# EAGLE design DUT-28bit-preCounter (EAGLE 5.07)
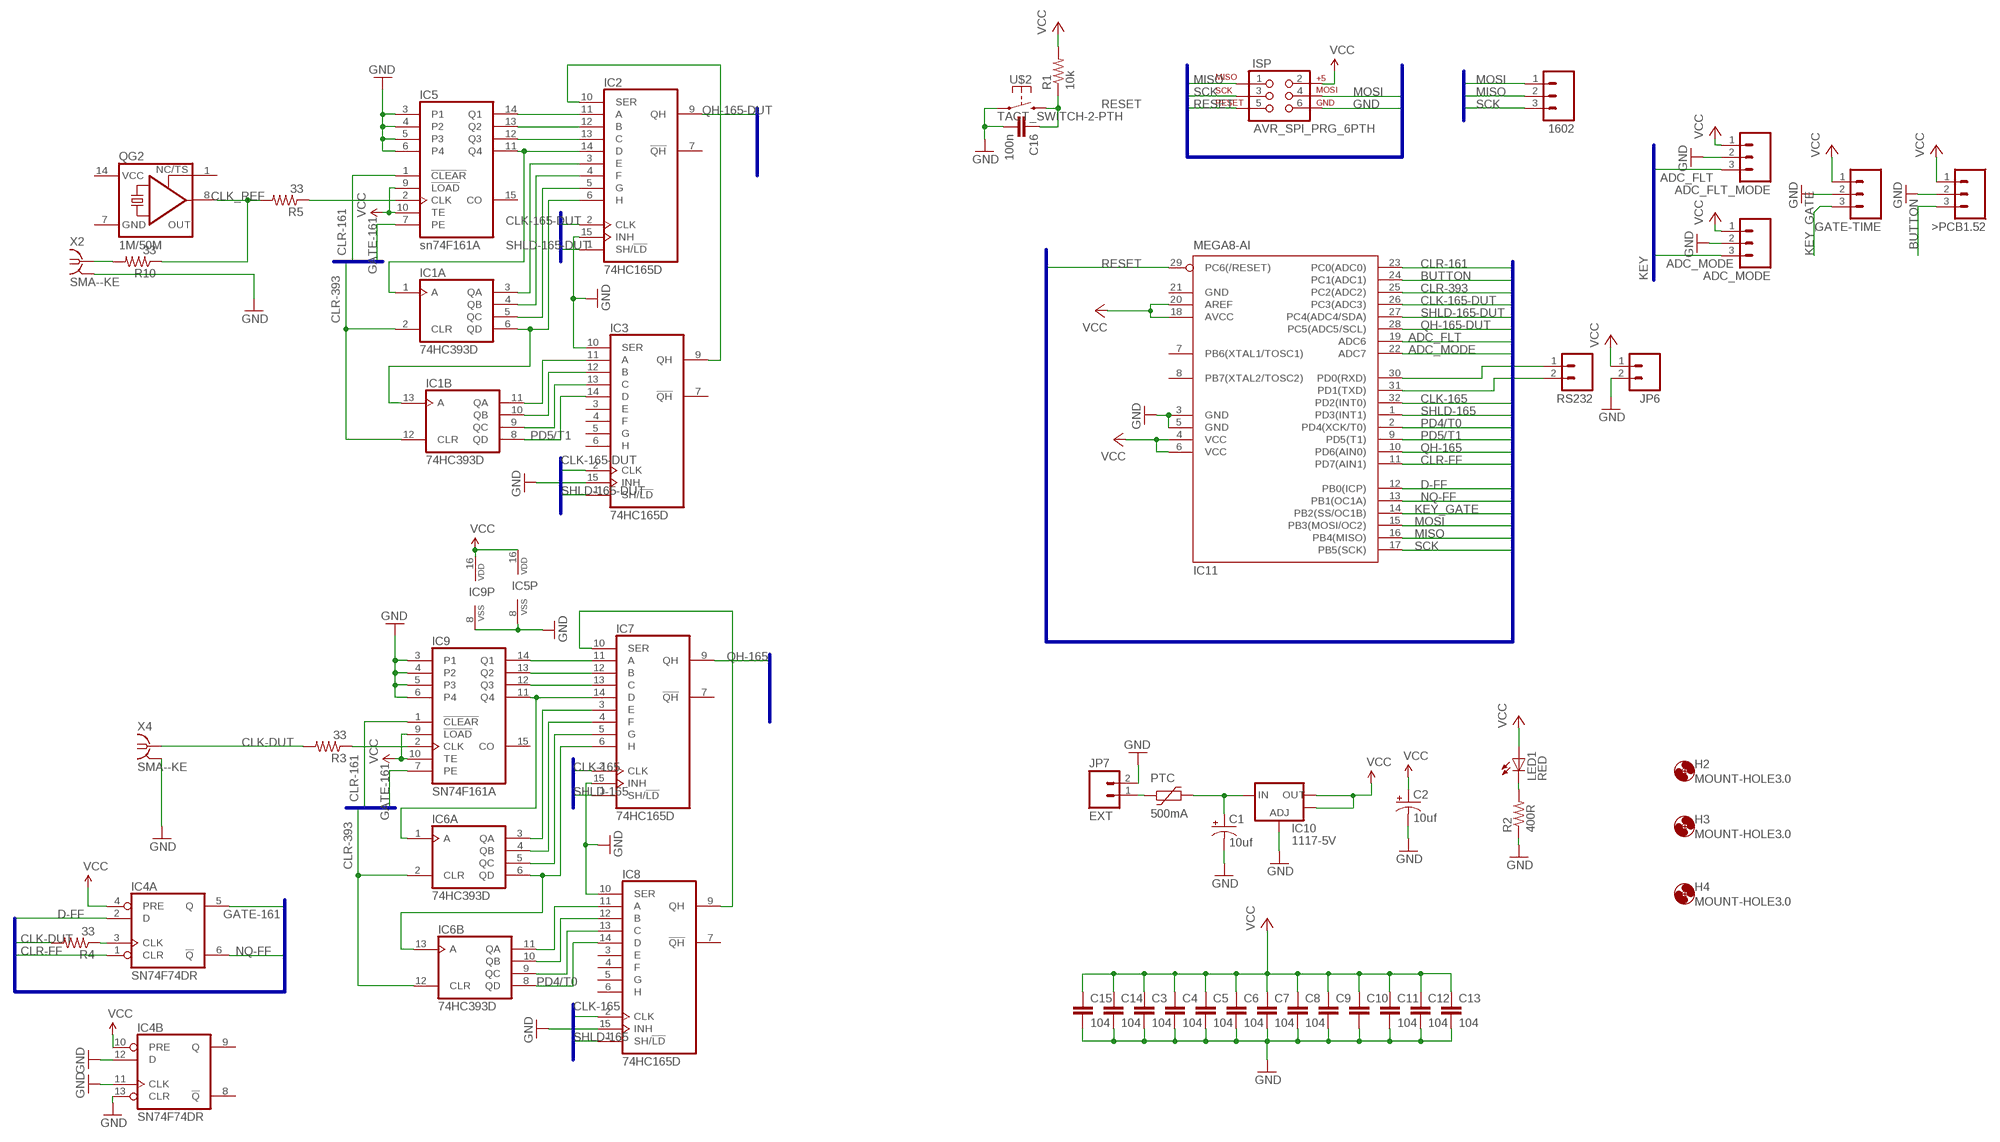
[diagram p0: schematic, sheet 1]

## Parts
1602  M03LOCK_LONGPADS  [1X03_LOCK_LONGPADS]
>PCB1.52  M03PTH  [1X03]
ADC_FLT_MODE  M03PTH  [1X03]
ADC_MODE  M03PTH  [1X03]
C1  10uf  CAP_POL7343  [EIA7343]
C2  10uf  CAP_POL7343  [EIA7343]
C3  104  CAP-C0805K  [C0805K]
C4  104  CAP-C0805K  [C0805K]
C5  104  CAP-C0805K  [C0805K]
C6  104  CAP-C0805K  [C0805K]
C7  104  CAP-C0805K  [C0805K]
C8  104  CAP-C0805K  [C0805K]
C9  CAP-C0805K  [C0805K]
C10  CAP-C0805K  [C0805K]
C11  104  CAP-C0805K  [C0805K]
C12  104  CAP-C0805K  [C0805K]
C13  104  CAP-C0805K  [C0805K]
C14  104  CAP-C0805K  [C0805K]
C15  104  CAP-C0805K  [C0805K]
C16  100n  CAP-C0805K  [C0805K]
GATE-TIME  M03PTH  [1X03]
H2  MOUNT-HOLE3.0  [3,0]
H3  MOUNT-HOLE3.0  [3,0]
H4  MOUNT-HOLE3.0  [3,0]
IC1  74HC393D  [SO14]
IC2  74HC165D  [SO16]
IC3  74HC165D  [SO16]
IC4  SN74F74DR  74HC74D  [SO14]
IC5  sn74F161A  4161D  [SO16]
IC6  74HC393D  [SO14]
IC7  74HC165D  [SO16]
IC8  74HC165D  [SO16]
IC9  SN74F161A  4161D  [SO16]
IC10  1117-5V  V_REG_LM1117SOT223  [SOT223]
IC11  MEGA8-AI  [TQFP32-08]
ISP  AVR_SPI_PRG_6PTH  [2X3]
JP6  CON-02PTH  [1X02]
JP7  EXT  CON-02-XH  [XH-1X2-LONG-LOCK]
LED1  RED  LEDCHIP-LED0805  [CHIP-LED0805]
PTC  500mA  PTC-FUSE1812L  [1812L]
QG2  1M/50M  XO-14  [DIL14S]
R1  10k  RESISTOR0805  [0805]
R2  400R  RESISTOR0805  [0805]
R3  33  RESISTOR0805  [0805]
R4  33  RESISTOR0805  [0805]
R5  33  RESISTOR0805  [0805]
R10  33  RESISTOR0805  [0805]
RS232  CON-02PTH  [1X02]
U$2  TACT_SWITCH-2-PTH  [ALPS-SKHV]
X2  SMA--KE  [SMA-KE]
X4  SMA--KE  [SMA-KE]

## Nets
ADC_FLT: ADC_FLT_MODE.3 IC11.19(ADC6)
ADC_MODE: ADC_MODE.3 IC11.22(ADC7)
BUTTON: >PCB1.52.3 IC11.24(PC1(ADC1))
CLK-165: IC7.2(CLK) IC8.2(CLK) IC11.32(PD2(INT0))
CLK-165-DUT: IC2.2(CLK) IC3.2(CLK) IC11.26(PC3(ADC3))
CLK-DUT: R3.2 R4.2 X4.1
CLK_REF: QG2.8(OUT) R5.2 R10.1
CLR-161: IC5.1(!CLEAR) IC9.1(!CLEAR) IC11.23(PC0(ADC0))
CLR-393: IC1.2(A:CLR) IC1.12(B:CLR) IC6.2(A:CLR) IC6.12(B:CLR) IC11.25(PC2(ADC2))
CLR-FF: IC4.1(A:CLR) IC11.11(PD7(AIN1))
D-FF: IC4.2(A:D) IC11.12(PB0(ICP))
GATE-161: IC4.5(A:Q) IC5.7(PE) IC9.7(PE)
GND: >PCB1.52.2 ADC_FLT_MODE.2 ADC_MODE.2 C1.C(-) C2.C(-) C3.2 C4.2 C5.2 C6.2 C7.2 C8.2 C9.2 C10.2 C11.2 C12.2 C13.2 C14.2 C15.2 C16.2 GATE-TIME.2 IC2.15(INH) IC3.10(SER) IC3.15(INH) IC4.11(B:CLK) IC4.12(B:D) IC4.13(B:CLR) IC5.3(P1) IC5.4(P2) IC5.5(P3) IC5.6(P4) IC5.8(VSS) IC7.15(INH) IC8.10(SER) IC8.15(INH) IC9.3(P1) IC9.4(P2) IC9.5(P3) IC9.6(P4) IC9.8(VSS) IC10.1(ADJ) IC11.3(GND) IC11.5(GND) ISP.6 JP6.2 JP7.2 R2.1 U$2.2 X2.G@1(GND) X4.G@1(GND)
KEY_GATE: GATE-TIME.3 IC11.14(PB2(SS/OC1B))
MISO: 1602.2 IC11.16(PB4(MISO)) ISP.1
MOSI: 1602.1 IC11.15(PB3(MOSI/OC2)) ISP.4
N$1: IC2.11(A) IC5.14(Q1)
N$2: IC2.12(B) IC5.13(Q2)
N$3: IC2.13(C) IC5.12(Q3)
N$4: JP7.1 PTC.P$1
N$5: IC1.3(A:QA) IC2.3(E)
N$6: IC1.4(A:QB) IC2.4(F)
N$7: IC1.5(A:QC) IC2.5(G)
N$8: IC1.6(A:QD) IC1.13(B:A) IC2.6(H)
N$9: IC1.1(A:A) IC2.14(D) IC5.11(Q4)
N$10: IC1.11(B:QA) IC3.11(A)
N$11: IC1.10(B:QB) IC3.12(B)
N$12: IC1.9(B:QC) IC3.13(C)
N$13: IC11.30(PD0(RXD)) RS232.1
N$14: C1.A(+) IC10.3(IN) PTC.P$2
N$15: IC2.10(SER) IC3.9(QH)
N$16: IC7.11(A) IC9.14(Q1)
N$17: IC7.12(B) IC9.13(Q2)
N$18: IC7.13(C) IC9.12(Q3)
N$19: R10.2 X2.1
N$20: IC6.3(A:QA) IC7.3(E)
N$21: IC6.4(A:QB) IC7.4(F)
N$22: IC6.5(A:QC) IC7.5(G)
N$23: IC6.6(A:QD) IC6.13(B:A) IC7.6(H)
N$24: IC6.11(B:QA) IC8.11(A)
N$25: IC6.10(B:QB) IC8.12(B)
N$26: IC6.9(B:QC) IC8.13(C)
N$27: IC11.31(PD1(TXD)) RS232.2
N$28: IC6.1(A:A) IC7.14(D) IC9.11(Q4)
N$29: IC4.3(A:CLK) R4.1
N$30: IC7.10(SER) IC8.9(QH)
N$31: IC9.2(CLK) R3.1
N$32: LED1.C R2.2
N$45: IC5.2(CLK) R5.1
NQ-FF: IC4.6(A:!Q) IC11.13(PB1(OC1A))
PD4/T0: IC6.8(B:QD) IC8.14(D) IC11.2(PD4(XCK/T0))
PD5/T1: IC1.8(B:QD) IC3.14(D) IC11.9(PD5(T1))
QH-165: IC7.9(QH) IC11.10(PD6(AIN0))
QH-165-DUT: IC2.9(QH) IC11.28(PC5(ADC5/SCL))
RESET: C16.1 IC11.29(PC6(/RESET)) ISP.5 R1.1 U$2.3
SCK: 1602.3 IC11.17(PB5(SCK)) ISP.3
SHLD-165: IC7.1(SH/!LD) IC8.1(SH/!LD) IC11.1(PD3(INT1))
SHLD-165-DUT: IC2.1(SH/!LD) IC3.1(SH/!LD) IC11.27(PC4(ADC4/SDA))
VCC: >PCB1.52.1 ADC_FLT_MODE.1 ADC_MODE.1 C2.A(+) C3.1 C4.1 C5.1 C6.1 C7.1 C8.1 C9.1 C10.1 C11.1 C12.1 C13.1 C14.1 C15.1 GATE-TIME.1 IC4.4(A:PRE) IC4.10(B:PRE) IC5.9(!LOAD) IC5.10(TE) IC5.16(VDD) IC9.9(!LOAD) IC9.10(TE) IC9.16(VDD) IC10.2(OUT) IC10.4(OUT) IC11.4(VCC) IC11.6(VCC) IC11.18(AVCC) IC11.20(AREF) ISP.2 JP6.1 LED1.A R1.2
Unconnected: IC2.7(!QH) IC3.3(E) IC3.4(F) IC3.5(G) IC3.6(H) IC3.7(!QH) IC4.8(B:!Q) IC4.9(B:Q) IC5.15(CO) IC7.7(!QH) IC8.3(E) IC8.4(F) IC8.5(G) IC8.6(H) IC8.7(!QH) IC9.15(CO) IC11.7(PB6(XTAL1/TOSC1)) IC11.8(PB7(XTAL2/TOSC2)) QG2.1(TS)

## Buses
MEGA-BUS
KEY

## Power pins joined to a net without a drawn wire
GND: IC1.7(P:GND) IC2.8(GND) IC3.8(GND) IC4.7(P:GND) IC6.7(P:GND) IC7.8(GND) IC8.8(GND) IC11.21(GND) QG2.7(GND) X2.G@2(GND) X2.G@3(GND) X2.G@4(GND) X4.G@2(GND) X4.G@3(GND) X4.G@4(GND)
VCC: IC1.14(P:VCC) IC2.16(VCC) IC3.16(VCC) IC4.14(P:VCC) IC6.14(P:VCC) IC7.16(VCC) IC8.16(VCC) QG2.14(VCC)

## Library data of the parts
1602 >PCB1.52 ADC_FLT_MODE ADC_MODE GATE-TIME = SparkFun:M03: Header 3 Standard 3-pin 0.1" header. Use with straight break away headers (SKU : PRT-00116), right angle break away headers (PRT-00553), swiss pins (PRT-00743), machine pins (PRT-00117), and female headers (PRT-00115). Molex polarized connector foot print use with SKU : PRT-08232 with associated crimp pins and housings.
C1 C2 = digital-toy:CAP_POL: Capacitor Polarized These are standard SMD and PTH capacitors. Normally 10uF, 47uF, and 100uF in electrolytic and tantalum varieties. Always verify the external diameter of the through hole cap, it varies with capacity, voltage, and manufacturer. The EIA devices should be standard. PANASONIC_D size: 6.5mmx6.5mmx5.5mm, 100uf (taobao:6.3mmx5.5mm), same as CVL0605 153cvl0405 size: 4mmx4mmx5.5mm, 10uf (taobao:4mmx5.5mm) ct6032 typical 47uF Tantalum, comment by hyl.
C3-C16 = digital-toy:CAP: Capacitor Standard 0603 ceramic capacitor, and 0.1" leaded capacitor.
H2-H4 = holes:MOUNT-HOLE: MOUNTING HOLE with drill center marker
IC1 IC6 = 74xx-eu:74*393: Dual 4-bit decade and binary COUNTER
IC2 IC3 IC7 IC8 = 74xx-eu:74*165: 8-bit parallel load SHIFT REGISTER
IC4 = 74xx-eu:74*74: Dual D type positive edge triggered FLIP FLOP, preset and clear
IC5 IC9 = 40xx:4161: Synchronous presettable 4-bit binary COUNTER
IC10 = SparkFun:V_REG_LM1117: Voltage Regulator LM1117 Standard adjustable voltage regulator but in SMD form. Spark Fun Electronics SKU : COM-00595
IC11 = atmel:MEGA8: MICROCONTROLLER 8 Kbytes FLASH, 1 kbytes SRAM, 512 bytes EEPROM, USART, 6-channel 10 bit ADC, 2-channel 8 bit ADC Pin compatible with Atmega48, ATMega88, ATMega168 Source: avr.lbr
ISP = SparkFun:AVR_SPI_PRG_6: AVR ISP 6 Pin This is the reduced ISP connector for AVR programming. Common on Arduino. This footprint will take up less PCB space and can be used with a 10-pin to 6-pin adapter such as SKU: BOB-08508
JP6 JP7 RS232 = digital-toy:CON-02: Header 2 Standard 2-pin 0.1" header. Use with straight break away headers (SKU : PRT-00116), right angle break away headers (PRT-00553), swiss pins (PRT-00743), machine pins (PRT-00117), and female headers (PRT-00115). Molex polarized connector foot print use with SKU : PRT-08233 with associated crimp pins and housings.
LED1 = led:LED: LED OSRAM: - CHIPLED LG R971, LG N971, LY N971, LG Q971, LY Q971, LO R971, LY R971 LH N974, LH R974 LS Q976, LO Q976, LY Q976 LO Q996 - Hyper CHIPLED LW Q18S LB Q993, LB Q99A, LB R99A - SideLED LS A670, LO A670, LY A670, LG A670, LP A670 LB A673, LV A673, LT A673, LW A673 LH A674 LY A675 LS A676, LA A676, LO A676, LY A676, LW A676 LS A679, LY A679, LG A679 - Hyper Micro SIDELED® LS Y876, LA Y876, LO Y876, LY Y876 LT Y87S - SmartLED LW L88C, LW L88S LB L89C, LB L89S, LG L890 LS L89K, LO L89K, LY L89K LS L896, LA L896, LO L896, LY L896 - TOPLED LS T670, LO T670, LY T670, LG T670, LP T670 LSG T670, LSP T670, LSY T670, LOP T670, LYG T670 LG T671, LOG T671, LSG T671 LB T673, LV T673, LT T673, LW T673 LH T674 LS T676, LA T676, LO T676, LY T676, LB T676, LH T676, LSB T676, LW T676 LB T67C, LV T67C, LT T67C, LS T67K, LO T67K, LY T67K, LW E67C LS E67B, LA E67B, LO E67B, LY E67B, LB E67C, LV E67C, LT E67C LW T67C LS T679, LY T679, LG T679 LS T770, LO T770, LY T770, LG T770, LP T770 LB T773, LV T773, LT T773, LW T773 LH T774 LS E675, LA E675, LY E675, LS T675 LS T776, LA T776, LO T776, LY T776, LB T776 LHGB T686 LT T68C, LB T68C - Hyper Mini TOPLED® LB M676 - Mini TOPLED Santana® LG M470 LS M47K, LO M47K, LY M47K Source: http://www.osram.convergy.de LUXEON: - LUMILED® LXK2-PW12-R00, LXK2-PW12-S00, LXK2-PW14-U00, LXK2-PW14-V00 LXK2-PM12-R00, LXK2-PM12-S00, LXK2-PM14-U00 LXK2-PE12-Q00, LXK2-PE12-R00, LXK2-PE12-S00, LXK2-PE14-T00, LXK2-PE14-U00 LXK2-PB12-K00, LXK2-PB12-L00, LXK2-PB12-M00, LXK2-PB14-N00, LXK2-PB14-P00, LXK2-PB14-Q00 LXK2-PR12-L00, LXK2-PR12-M00, LXK2-PR14-Q00, LXK2-PR14-R00 LXK2-PD12-Q00, LXK2-PD12-R00, LXK2-PD12-S00 LXK2-PH12-R00, LXK2-PH12-S00 LXK2-PL12-P00, LXK2-PL12-Q00, LXK2-PL12-R00 Source: www.luxeon.com KINGBRIGHT: KA-3528ASYC Source: www.kingbright.com
PTC = digital-toy:PTC-FUSE
QG2 = digital-toy:XO-: CRYSTAL
R1-R5 R10 = digital-toy:RESISTOR: Resistor Basic schematic elements and footprints for 0603, 1206, and PTH 1/10th watt (small) resistors. digital-toy copy vertical mount of axial-0.3 from rcl.lbr : the 0207/xx
U$2 = digital-toy:TACT_SWITCH-2
X2 X4 = dtoy-RF:SMA-: SMA 50 Ohm End Launch Jack Receptacle - Round Contact Johnson Components Source: www.johnsoncomponents.com .. J502-ND.pdf

## Board
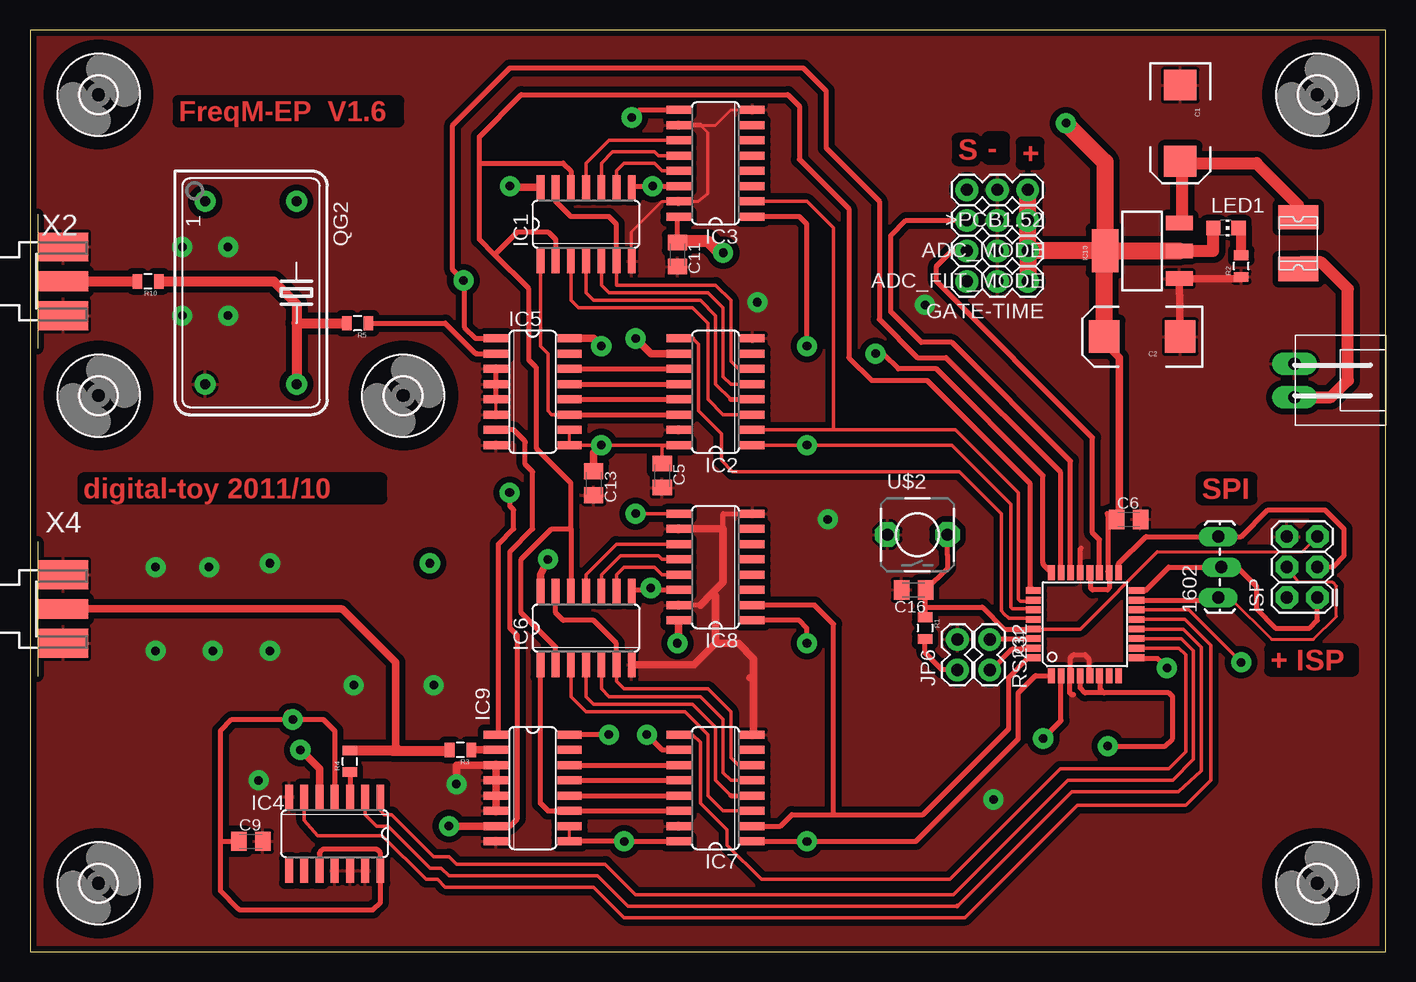
[diagram p1: board, top side]
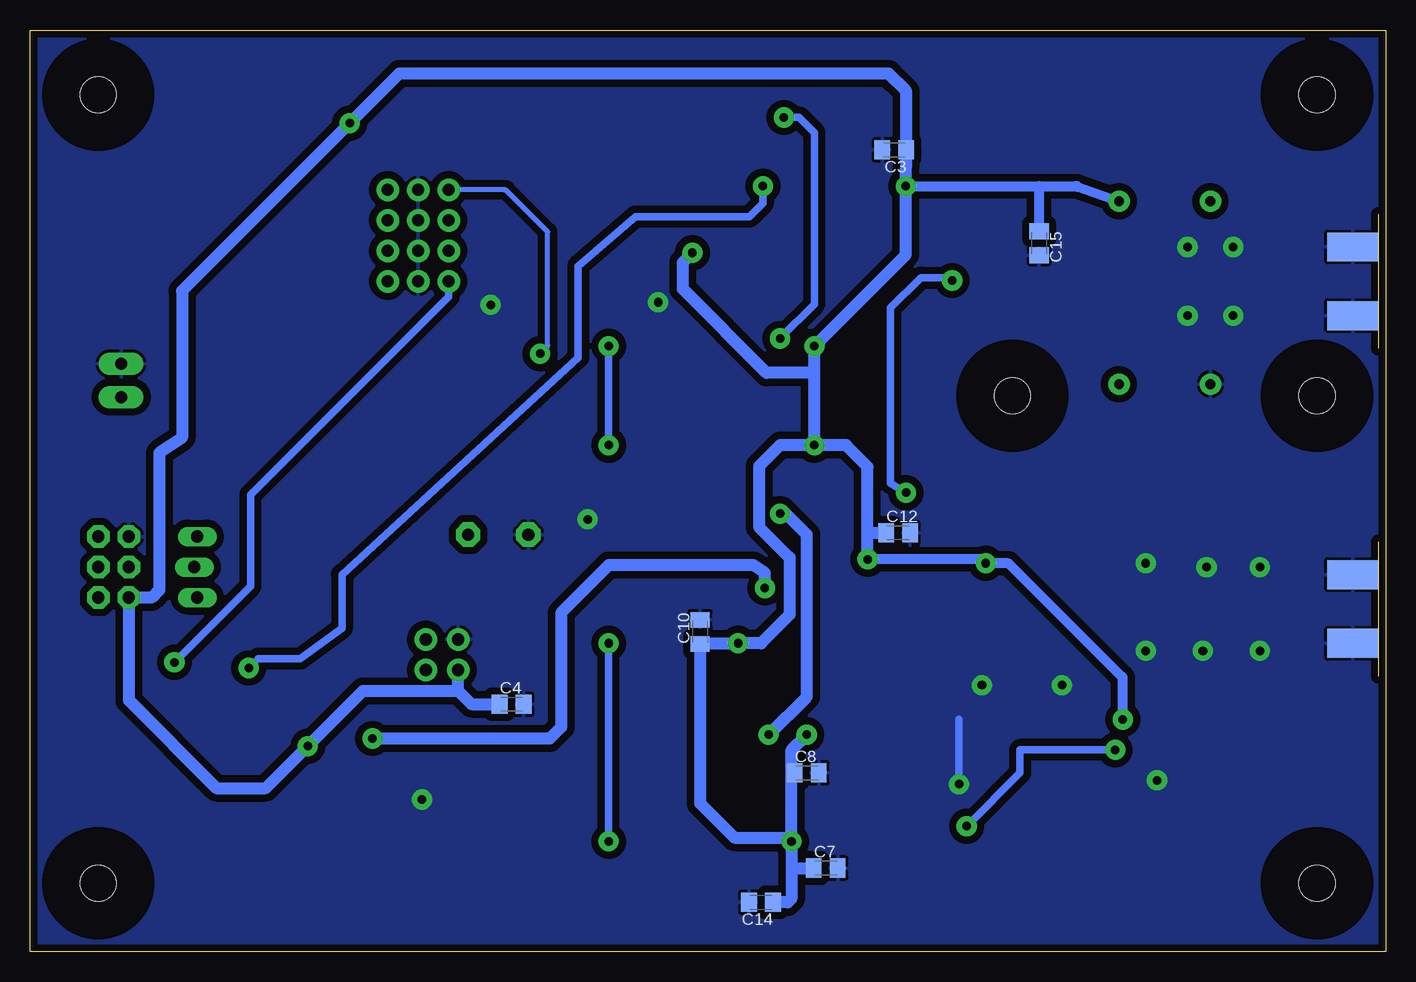
[diagram p2: board, bottom side, seen from below]

Size 113.01 x 76.82 mm. Coordinates in mm from the lower left corner, seen from the top.
Outline: 0,0 113.01,0 113.01,76.82 0,76.82 0,0
Copper layers (1*16): Top 0.035mm / dielectric 1.5mm / Bottom 0.035mm
Design rules "SparkFun": minimum track width 8mil, minimum drill 20mil, track to track 8mil, track to pad 8mil, pad to pad 8mil, via to via 8mil, smd to smd 8mil, copper to edge 10mil, drill to drill 8mil, minimum pad ring 12mil, minimum via ring 10mil, stop-mask expansion 4mil, vias tented up to drill 25mil, thermal gap 10mil

### Footprints (pad centres in the part's own frame; a part is rotated, then mirrored left to right if it is on the bottom)
1X03_LOCK_LONGPADS = drill 1.016 long: 1 0,0; 2 2.54,-0.254; 3 5.08,0
1X03 = drill 1.016 pad 1.88 round: 1 0,0; 2 2.54,0; 3 5.08,0
EIA7343 = smd 2.55 x 2.7: A 3.17,0; C -3.17,0
C0805K = smd 1.3 x 1.6: 1 -1,0; 2 1,0
3,0 = hole 3: 0,0
SO14 = smd 0.66 x 2.032: 1 -3.81,-3.073; 2 -2.54,-3.073; 3 -1.27,-3.073; 4 0,-3.073; 5 1.27,-3.073; 6 2.54,-3.073; 7 3.81,-3.073; 8 3.81,3.073; 9 2.54,3.073; 10 1.27,3.073; 11 0,3.073; 12 -1.27,3.073; 13 -2.54,3.073; 14 -3.81,3.073
SO16 = smd 0.66 x 2.032: 1 -4.445,-3.073; 2 -3.175,-3.073; 3 -1.905,-3.073; 4 -0.635,-3.073; 5 0.635,-3.073; 6 1.905,-3.073; 7 3.175,-3.073; 8 4.445,-3.073; 9 4.445,3.073; 10 3.175,3.073; 11 1.905,3.073; 12 0.635,3.073; 13 -0.635,3.073; 14 -1.905,3.073; 15 -3.175,3.073; 16 -4.445,3.073
SOT223 = smd 1.219 x 2.235: 1 -2.311,-3.099; 2 0,-3.099; 3 2.311,-3.099 | smd 3.6 x 2.2: 4 0,3.099
TQFP32-08 = smd 1.27 x 0.559: 1 -4.293,2.8; 2 -4.293,2; 3 -4.293,1.2; 4 -4.293,0.4; 5 -4.293,-0.4; 6 -4.293,-1.2; 7 -4.293,-2; 8 -4.293,-2.8; 17 4.293,-2.8; 18 4.293,-2; 19 4.293,-1.2; 20 4.293,-0.4; 21 4.293,0.4; 22 4.293,1.2; 23 4.293,2; 24 4.293,2.8 | smd 0.559 x 1.27: 9 -2.8,-4.293; 10 -2,-4.293; 11 -1.2,-4.293; 12 -0.4,-4.293; 13 0.4,-4.293; 14 1.2,-4.293; 15 2,-4.293; 16 2.8,-4.293; 25 2.8,4.293; 26 2,4.293; 27 1.2,4.293; 28 0.4,4.293; 29 -0.4,4.293; 30 -1.2,4.293; 31 -2,4.293; 32 -2.8,4.293
2X3 = drill 1.016 pad 1.88 octagon: 1 0,0; 2 0,2.54; 3 2.54,0; 4 2.54,2.54; 5 5.08,0; 6 5.08,2.54
1X02 = drill 1.016 pad 1.88 round: 1 0,0; 2 2.54,0
XH-1X2-LONG-LOCK = drill 1.016 pad 1.88 long: 1 1.397,0; 2 -1.397,0
CHIP-LED0805 = smd 1.2 x 1.2: A 0,-1.05; C 0,1.05
1812L = smd 2.03 x 3.3: P$1 -2.16,0; P$2 2.16,0
DIL14S = drill 0.813 pad 1.778 round: 1 -7.62,-3.81; 7 7.62,-3.81; 8 7.62,3.81; 14 -7.62,3.81
0805 = smd 0.8 x 1.2: 1 -0.9,0; 2 0.9,0
ALPS-SKHV = drill 1.016 pad 2.032 octagon: 2 -2.51,0; 3 2.51,0
SMA-KE = smd 4.191 x 1.651: 1 2.115,0 | smd 4.191 x 2.413: G@1 2.115,2.86; G@2 2.115,-2.86 | smd 4.191 x 2.413 bottom: G@3 2.115,2.86; G@4 2.115,-2.86

### Placement (x,y rotation side)
1602  99.06,29.53 90 top
>PCB1.52  83.19,63.5 180 top
ADC_FLT_MODE  83.19,58.42 180 top
ADC_MODE  83.19,60.96 180 top
C1  95.89,69.06 270 top
C2  92.71,51.28 180 top
C3  40.96,66.83 180 bottom
C4  72.87,20.64 0 bottom
C5  52.7,39.69 270 top
C6  91.6,36.04 0 top
C7  46.67,6.99 0 bottom
C8  48.26,14.92 0 bottom
C9  18.41,9.21 0 top
C10  57.15,26.67 90 bottom
C11  53.98,58.1 270 top
C12  40.64,34.92 0 bottom
C13  46.99,39.05 270 top
C14  52.07,4.13 180 bottom
C15  28.89,59.05 270 bottom
C16  73.66,30.16 180 top
GATE-TIME  83.19,55.88 180 top
H1  MOUNT-HOLE3.0  [3,0]  5.71,71.44 0 top
H2  107.31,5.71 0 top
H3  107.31,71.44 0 top
H4  5.71,5.71 0 top
H5  MOUNT-HOLE3.0  [3,0]  5.71,46.35 0 top
H6  MOUNT-HOLE3.0  [3,0]  31.11,46.35 0 top
IC1  46.35,60.64 0 top
IC2  57.15,46.67 90 top
IC3  57.15,65.72 90 top
IC4  25.4,9.84 180 top
IC5  41.91,46.67 270 top
IC6  46.35,26.99 0 top
IC7  57.15,13.65 90 top
IC8  57.15,32.07 90 top
IC9  41.91,13.65 270 top
IC10  92.71,58.42 90 top
IC11  87.95,27.3 90 top
ISP  107.31,29.53 90 top
JP6  77.31,23.5 90 top
JP7  105.41,47.62 270 top
LED1  99.69,60.33 270 top
PTC  105.73,59.05 90 top
QG2  18.41,54.93 270 top
R1  74.61,26.99 270 top
R2  100.97,57.15 90 top
R3  35.88,16.83 180 top
R4  26.67,15.88 90 top
R5  27.3,52.39 180 top
R10  9.84,55.88 180 top
RS232  80.01,26.04 270 top
U$2  73.98,34.77 0 top
X2  0.64,55.88 0 top
X4  0.64,28.57 0 top

### Tracks (layer width: path | path; a pad name or v marks a point on that pad's centre or on a via)
ADC_FLT
  Top 0.406: IC11.19 89.15,34.36 88.58,34.92 88.58,42.86 75.56,55.88 75.56,57.15 76.83,58.42 ADC_FLT_MODE.3
ADC_MODE
  Top 0.406: IC11.22 86.75,40.89 76.83,50.8 74.3,50.8 71.75,53.34 71.75,59.69 73.03,60.96 ADC_MODE.3
BUTTON  (via drill 0.71 pad 1.68)
  Top 0.406: IC11.24 84.53,32.22 arc-45 84.45,32.4 84.45,39.69 75.56,48.58 72.39,48.58 71.19,49.77 arc45 71.02,49.85 v70.48,49.85
  Bottom 0.406: >PCB1.52.3 73.45,63.5 arc45 73.27,63.43 69.85,60.01 69.85,50.59 arc45 69.92,50.41 v70.48,49.85
CLK-165
  Top 0.406: IC8.2 65.41,28.89 66.99,27.3 66.99,11.43 | IC7.2 62.55,10.48 63.5,11.43 66.99,11.43 | IC11.32 83.24,24.5 81.6,22.86 81.6,18.57 74.45,11.43 66.99,11.43
CLK-165-DUT
  Top 0.254: 83.56,29.21 IC11.26
  Top 0.305: IC3.2 64.77,62.55 66.99,60.33 66.99,43.5 | 83.56,29.21 82.55,29.21 82.39,29.37 82.39,38.26 | IC2.2 66.99,43.5 | 82.39,38.26 | 82.39,38.26 77.15,43.5 66.99,43.5
CLK-DUT
  Top 0.61: X4.1 25.93,28.57 arc-45 26.11,28.5 30.48,24.13 30.48,17.2 arc-45 30.41,17.02 30.16,16.77
  Top 0.813: R4.2 30.16,16.77 30.48,16.77 | 30.48,16.77 34.85,16.77 arc45 R3.2 | 30.48,16.77 arc45 30.55,16.95
CLK_REF
  Top 0.813: R10.1 20.21,55.88 arc-45 20.39,55.81 22.23,53.98 22.23,52.39 | 22.23,52.39 QG2.8 | 22.23,52.39 R5.2
CLR-161  (via drill 0.71 pad 1.68)
  Top 0.254: IC9.1 38.84,18.2 | 40.01,38.24 v39.98,38.27
  Top 0.406: 38.84,18.2 39.05,18.1 39.05,33.97 40.32,35.24 40.32,36.83 40.01,37.15 40.01,38.24 | IC5.1 37.15,51.12 36.2,52.07 36.2,55.69 v36.13,55.94 35.24,56.83 35.24,68.9 40.01,73.66 64.45,73.66 66.36,71.75 66.36,66.99 70.8,62.55 70.8,52.7 73.98,49.53 76.36,49.53 85.88,40.01 85.88,31.66 IC11.23
  Bottom 0.406: 36.83,56.2 36.7,56.2
  Bottom 0.61: 36.83,56.2 38.73,56.2 41.27,53.66 41.27,39.05 v39.98,38.27 | 36.7,56.2 v36.13,55.94
CLR-393
  Top 0.406: 45.09,35.24 IC6.12 | 45.09,35.24 45.09,39.05 42.3,41.84 arc-45 42.23,42.02 42.23,48.58 arc45 42.15,48.76 41.59,49.32 41.59,55.24 38.73,58.1 | IC6.2 43.81,25.4 40.96,28.26 40.96,32.7 43.5,35.24 45.09,35.24 | 38.73,58.1 37.47,59.37 37.47,65.72 | 37.47,65.72 37.47,67.94 40.96,71.44 63.18,71.44 64.14,70.48 64.14,66.04 68.26,61.91 68.26,49.53 70.17,47.62 74.77,47.62 83.34,39.05 83.34,30.42 IC11.25 | IC1.12 45.09,65.09 44.45,65.72 37.47,65.72 | IC1.2 43.81,59.37 43.18,60.01 40.64,60.01 38.73,58.1
CLR-FF
  Top 0.305: IC11.11 95.97,26.11 97,25.08 97,16.03 95.25,14.29 86.52,14.29 76.99,4.76 50.48,4.76 47.94,7.3 35.56,7.3 34.92,7.94 33.66,7.94 30.16,11.43 29.53,11.43 29.21,11.75 IC4.1
D-FF
  Top 0.305: IC11.12 96.13,26.91 97.63,25.4 97.63,15.08 95.73,13.34 86.84,13.34 77.31,3.81 49.85,3.81 47.31,6.35 34.92,6.35 34.29,6.99 33.34,6.99 29.84,10.48 28.89,10.48 27.94,11.43 IC4.2
  Top 0.406: 77.31,3.81
GATE-161  (via drill 0.71 pad 1.68)
  Top 0.406: IC9.7 40.01,10.48 40.64,11.11 40.64,26.35 40.01,26.99 40.01,33.34 41.91,35.24 41.91,40.01 41.27,40.64 41.27,42.44 arc45 41.2,42.62 40.32,43.5 IC5.7
  Top 0.61: v34.92,10.48 IC9.7 | IC4.5 24.13,15.24 v22.54,16.83
  Bottom 0.61: v34.92,10.48 30.48,14.92 30.48,16.83 v22.54,16.83
GND  (via drill 0.71 pad 1.68)
  Top 0.254: IC5.6 IC5.5 | IC1.7 50.16,60.01 52.7,62.55 IC3.15 55.72,62.55 56.52,63.18 56.52,68.26 55.88,68.9 | 95.81,55.98 IC10.1 | IC3.10 57.15,68.9 58.42,70.17 IC3.8
  Top 0.406: IC5.5 IC5.4 IC5.3 | 57.78,35.24 57.78,36.51 IC8.8 | 55.88,28.89 IC8.15 | 55.88,68.9 IC3.10 | 87,21.43 86.84,21.43 86.68,21.59 86.68,22.94 IC11.3 86.75,24.52 87,24.77 87.95,24.77 88.27,24.45 88.27,23.09 IC11.5 | IC11.21 87.55,33.57 87.63,33.66
  Top 0.61: IC8.10 57.78,35.24 57.78,30.8 56.83,29.84 | IC6.7 55.35,23.91 57.15,25.72 | IC7.8 60.33,18.1 60.33,22.86 | 60.33,22.86 60.33,24.45 59.05,25.72 57.15,25.72 | IC9.6 IC9.5 IC9.4 IC9.3 35.56,15.56 v35.56,13.97 | C2.C 95.81,55.98 | IC10.1 100.97,56.11 R2.1 | 60.33,22.86 60.01,22.86 | 56.83,29.84 55.88,28.89 | 57.15,25.72 57.15,29.53 arc90 56.83,29.84
  Bottom 0.61: v35.56,13.97 35.56,19.37
  other vias: 60.64,54.13 66.52,36.04 80.33,12.7 33.66,22.23 74.61,53.91 19.05,14.29 26.99,22.23 10.48,32.07 14.92,32.07 20,32.38 10.48,25.08 15.24,25.08 12.7,53.02 16.51,53.02 12.7,58.74 16.51,58.74 20,25.08
  pour Top (isolate 0.508): -1.27,83.5 116.2,80.33 120.81,78.42 129.7,15.88 118.11,-7.94 18.41,-7.94 -14.92,-4.76 -14.92,67.63
  pour Bottom (isolate 0.61): 0.64,82.23 115.57,84.14 147.32,58.1 144.46,-7.46 116.84,-4.13 27.94,-3.49 -8.89,-2.86 -8.89,72.71
KEY_GATE  (via drill 0.71 pad 1.68)
  Top 0.305: IC11.14 96.59,28.5 v100.97,24.13
  Bottom 0.61: v100.97,24.13 94.61,30.48 94.61,38.1 78.11,54.61 GATE-TIME.3
MISO
  Top 0.406: IC11.16 92.97,30.11 94.93,32.07 1602.2 100.65,32.07 102.23,30.48 102.23,28.57 103.82,26.99 106.68,26.99 107.31,27.62 ISP.1
MOSI
  Top 0.254: 1602.1 100.01,29.53 103.5,26.04 107,26.04 108.9,27.94 108.9,30.48 108.58,30.8 105.73,30.8 ISP.4
  Top 0.406: IC11.15 98.84,29.3 1602.1
N$1
  Top 0.406: IC5.14 IC2.11
N$2
  Top 0.406: IC5.13 IC2.12
N$3
  Top 0.406: IC5.12 IC2.13
N$4
  Top 0.406: 105.92,57.47 PTC.P$1
  Top 1.016: JP7.1 108.46,46.23 109.86,47.62 109.86,55.24 107.63,57.47 105.92,57.47
N$5
  Top 0.305: IC2.3 57.78,44.77 56.52,46.04 56.52,52.39 55.24,53.66 45.72,53.66 45.09,54.29 IC1.3
N$6
  Top 0.305: IC1.4 46.35,54.93 46.99,54.29 55.88,54.29 57.15,53.02 57.15,47.31 58.42,46.04
  Top 0.406: 58.42,46.04 IC2.4
N$7
  Top 0.305: IC2.5 58.42,47.31 57.78,47.94 57.78,53.66 56.52,54.93 48.26,54.93 47.62,55.56 IC1.5
N$8
  Top 0.305: IC1.6 48.9,55.56 57.15,55.56 58.42,54.29 58.42,49.21 59.05,48.58 IC2.6
  Top 0.406: IC1.13 43.81,62.55 45.09,61.28 48.26,61.28 48.9,60.64 IC1.6
N$9
  Top 0.305: IC1.1 42.55,50.48 43.18,49.85 43.18,45.09 43.5,44.77 IC5.11
  Top 0.406: IC5.11 IC2.14
N$10
  Top 0.305: IC1.11 46.35,65.72 48.26,67.63 IC3.11
N$11
  Top 0.305: IC1.10 47.62,65.72 48.58,66.67 52.07,66.67 52.39,66.36 IC3.12
N$12
  Top 0.305: IC1.9 48.9,65.09 49.53,65.72 52.07,65.72 52.7,65.09 IC3.13
N$13
  Top 0.406: IC11.30 80.08,26.11 RS232.1
N$14
  Top 0.406: 96.05,65.72 C1.A | IC10.3 96.05,60.97
  Top 1.016: PTC.P$2 105.73,62.23 102.23,65.72 96.05,65.72 96.05,60.97
N$15  (via drill 0.71 pad 1.68)
  Top 0.406: IC3.9 50.8,70.17 v50.16,69.53
  Top 0.61: IC2.10 51.75,49.85 v50.48,51.12
  Bottom 0.61: v50.16,69.53 48.9,69.53 47.62,68.26 47.62,53.98 v50.48,51.12
N$16
  Top 0.406: IC9.14 IC7.11
N$17
  Top 0.406: IC9.13 IC7.12
N$18
  Top 0.406: IC9.12 IC7.13
N$19
  Top 0.813: X2.1 R10.2
N$20
  Top 0.305: IC6.3 45.09,21.27 46.35,20 54.61,20 56.52,18.1 56.52,13.02 57.78,11.75 IC7.3
N$21
  Top 0.305: 58.42,13.02 57.15,14.29 57.15,18.73 55.24,20.64 46.99,20.64 46.35,21.27 IC6.4
  Top 0.406: 58.42,13.02 IC7.4
N$22
  Top 0.305: IC6.5 47.62,21.91 48.26,21.27 55.88,21.27 57.78,19.37 57.78,14.92 58.42,14.29 IC7.5
N$23
  Top 0.305: IC6.6 48.9,22.54 49.53,21.91 56.52,21.91 58.42,20 58.42,16.19 59.05,15.56 IC7.6
  Top 0.406: IC6.13 43.81,28.26 44.45,27.62 46.99,27.62 48.9,25.72 IC6.6
N$24
  Top 0.305: IC6.11 46.35,31.43 48.9,33.97 IC8.11
N$25
  Top 0.305: IC6.10 47.62,31.43 49.21,33.02 52.39,33.02 52.7,32.7 IC8.12
N$26
  Top 0.305: IC6.9 48.9,31.43 49.53,32.07 52.07,32.07 52.7,31.43 IC8.13
N$27
  Top 0.406: RS232.2 80.17,23.5 81.92,25.24 83.59,25.24 IC11.31
N$28
  Top 0.406: IC7.14 IC9.11 43.18,11.75 42.55,12.38 IC6.1
N$29
  Top 0.406: R4.1 IC4.3
N$30  (via drill 0.71 pad 1.68)
  Top 0.305: v50.48,36.51 IC8.9
  Top 0.406: IC7.10 52.7,16.83 v51.44,18.1
  Bottom 1.016: v51.44,18.1 48.26,21.27 48.26,34.77 50.01,36.51 v50.48,36.51
N$31
  Top 0.61: R3.1 IC9.2
N$32
  Top 0.254: 100.97,60.33 LED1.C
  Top 0.813: R2.2 100.97,60.33
N$45
  Top 0.406: IC5.2 37.25,49.85 arc-45 37.07,49.92 34.61,52.39 R5.1
NQ-FF
  Top 0.305: IC4.6 22.86,10.95 23.97,9.68 29.37,9.68 33.02,6.03 33.97,6.03 34.61,5.4 46.99,5.4 49.53,2.86 77.95,2.86 87.31,12.22 96.36,12.22 98.42,14.29 98.42,25.56 96.28,27.7 IC11.13
PD4/T0  (via drill 0.71 pad 1.68)
  Top 0.254: IC6.8 50.27,30.16
  Top 0.406: 50.27,30.16 51.91,30.16 | 51.91,30.16 IC8.14 | 51.91,30.16 v51.75,30.32 | v84.45,17.78 85.95,19.27 IC11.2
  Bottom 1.016: v51.75,30.32 51.75,31.59 52.7,32.23 64.77,32.23 68.74,28.26 68.74,18.73 69.69,17.78 v84.45,17.78
PD5/T1  (via drill 0.71 pad 1.68)
  Top 0.254: IC1.8 50.27,63.82
  Top 0.406: IC3.14 v51.91,63.82 50.27,63.82 | IC11.9 92.3,24.45 93.98,24.45 94.3,24.13 v94.77,23.65
  Bottom 0.406: 93.98,24.45 94.3,24.13
  Bottom 0.61: v51.91,63.82 51.91,62.39 53.02,61.28 62.55,61.28 67.31,57.15 67.31,49.53 87,31.43 87,26.99 90.49,24.45 93.98,24.45 | 94.3,24.13 v94.77,23.65
QH-165
  Top 0.305: IC7.9 55.24,18.1 55.88,17.46 55.88,12.38 58.1,10.16 58.1,8.89 60.96,6.03 76.68,6.03 85.88,15.24 94.93,15.24 96.36,16.67 96.36,24.77 95.79,25.3 IC11.10
QH-165-DUT
  Top 0.254: 83.58,27.78 IC11.28 | 81.2,28.18 81.12,28.26
  Top 0.305: 83.58,27.78 81.6,27.78 81.2,28.18 80.96,28.42 80.96,36.51 77.47,40.01 58.58,40.01 57.63,40.96 57.63,43.18 55.72,45.09 55.72,50.64 55.24,51.12
  Top 0.406: 55.24,51.12 54.77,51.12 54.61,51.28 54.23,51.28 IC2.9
RESET
  Top 0.254: 93.98,33.34 106.05,33.34 ISP.5
  Top 0.305: IC11.29 87.55,26.91 93.98,33.34
  Top 0.406: R1.1 74.66,27.93 74.66,28.73 | 74.66,28.73 C16.1 76.52,32.02 76.52,33.02 76.49,33.05 U$2.3 | IC11.29 81.2,26.91 79.38,28.73 74.66,28.73
SCK
  Top 0.406: IC11.17 90.75,32.33 93.03,34.61 1602.3 100.97,34.61 103.19,36.83 107.95,36.83 109.54,35.24 109.54,33.02 108.58,32.07 ISP.3
SHLD-165  (via drill 0.71 pad 1.68)
  Top 0.406: IC7.1 v64.77,9.21 73.85,9.21 82.39,17.75 82.39,21.59 83.81,23.01 IC11.1 | IC8.1 64.14,27.62 64.77,26.99 v64.77,25.72
  Bottom 0.61: v64.77,9.21 v64.77,25.72
SHLD-165-DUT  (via drill 0.71 pad 1.68)
  Top 0.254: 83.58,28.57 IC11.27
  Top 0.305: IC2.1 v64.77,42.23 65.88,42.23 67.79,42.23 | 83.58,28.57 81.92,28.57 81.76,28.73 81.76,37.31 76.83,42.23 67.79,42.23 | 67.79,42.23
  Top 0.406: IC3.1 64.14,61.28 64.77,60.64 v64.77,50.48
  Bottom 0.61: v64.77,42.23 v64.77,50.48
VCC  (via drill 0.71 pad 1.68)
  Top 0.254: IC5.9 IC5.10 | IC9.9 IC9.10 | v40.01,63.82 40.11,63.72
  Top 0.305: IC5.9 v47.62,42.23 IC2.16 52.7,42.13 C5.1 | 53.98,9.21 IC7.16
  Top 0.406: IC9.9 v49.53,9.21 53.98,9.21 | v48.26,18.1 IC9.16 | IC3.16 53.98,61.18 C11.1 54.09,59.21 | v57.78,58.26 57.47,58.26 | 89.22,23.08 IC11.6 89.22,22.94 89.22,21.91 89.53,21.59 | IC11.20 88.42,31.67 88.42,30.32 88.58,30.16 89.85,30.16 89.98,30.35 89.98,31.38 IC11.18 89.85,31.69 89.85,36.35 C6.1 | JP6.1 76.04,23.5 74.61,24.92 R1.2 | IC10.4 89.54,58.35 | C6.1 89.81,36.51 | IC11.4 87.55,21.99 87.95,21.59 89.53,21.59 | v86.36,69.06 86.12,68.81 | C6.1 90.81,35.83 90.81,35.56 | IC4.4 25.4,18.41 24.45,19.37 v21.91,19.37 16.83,19.37 15.88,18.41 15.88,9.21 | 15.88,9.21 15.88,5.08 17.39,3.57 arc45 17.57,3.49 28.57,3.49 29.21,4.13 IC4.14 29.21,8.26 28.97,8.5 arc45 28.79,8.57 24.45,8.57 24.2,8.33 arc45 24.13,8.15 IC4.10 | 15.88,9.21 C9.1 | 54.08,26.45 54.08,25.82 v53.98,25.72 | v89.85,17.14 94.61,17.14 95.25,17.78 95.25,21.27 94.93,21.59 89.53,21.59 | C2.A
  Top 0.61: 40.11,63.72 IC1.14 | IC5.16 46.99,51.12 v47.62,50.48 | IC6.14 42.55,31.43 v43.18,32.7 | 54.08,26.45 IC8.16 | C13.1 46.99,41.59 v47.62,42.23 | 90.81,35.56 90.81,49.53 89.53,50.8 C2.A
  Top 0.813: v21.91,19.37 arc90 v21.91,19.37 21.66,19.61 arc-45 21.59,19.79
  Top 1.016: IC10.2 98.64,58.42 LED1.A | 57.47,58.26 56.52,59.21 54.09,59.21
  Top 1.422: IC10.2 IC10.4 89.61,65.81 v86.36,69.06 | C2.A 89.54,58.35 89.47,58.42 ADC_FLT_MODE.1 | ADC_FLT_MODE.1 ADC_MODE.1 >PCB1.52.1 | ADC_FLT_MODE.1 GATE-TIME.1
  Bottom 0.406: 49.53,14.92 C8.1 | 49.69,28.26 49.69,28.1 | v53.98,25.72 54.02,25.67
  Bottom 0.61: v47.62,42.23 48.26,42.23
  Bottom 0.813: v21.91,19.37 21.91,22.75 arc-45 21.98,22.93 31.43,32.38 v33.34,32.38 33.58,32.63 arc-45 33.76,32.7 v43.18,32.7 | QG2.14 25.64,63.74 arc-45 25.82,63.82 28.89,63.82 | v40.01,63.82 28.89,63.82 | 28.89,63.82 C15.1
  Bottom 1.016: v47.62,42.23 47.62,48.26 | 47.62,48.26 v47.62,50.48 40.01,58.1 v40.01,63.82 C3.1 | v48.26,18.1 49.53,16.83 49.53,14.92 v49.53,9.21 | v57.78,58.26 58.58,57.47 58.58,55.24 51.59,48.26 47.62,48.26 | 49.69,28.26 49.69,32.86 52.23,35.4 52.23,40.48 50.48,42.23 v47.62,42.23 | C3.1 39.8,66.67 | 43.18,34.92 43.18,40.42 IC5.9 v47.62,42.23 | 43.18,34.92 v43.18,32.7 42.94,32.46 | 43.18,34.92 C12.1 | v49.53,9.21 49.53,6.99 | 49.53,6.99 C7.1 | 49.69,28.1 52.07,25.72 v53.98,25.72 | 54.02,25.67 C10.1 57.15,12.38 54.29,9.53 49.85,9.53 v49.53,9.21 | 77.31,21.75 JP6.1 | 77.31,21.75 76.2,20.64 C4.1 | 77.31,21.75 85.25,21.75 v89.85,17.14 93.34,13.65 97.47,13.65 104.78,20.95 ISP.2 102.87,29.53 102.23,30.16 102.23,41.59 100.33,42.86 100.33,55.09 v86.36,69.06 82.23,73.18 41.43,73.18 40.03,71.78 arc45 39.96,71.6 C3.1 | 49.53,6.99 49.53,4.55 arc45 49.6,4.37 49.85,4.13 C14.1

### Text on the board
Top: FreqM-EP V1.6 | S | - | + | digital-toy 2011/10 | SPI | + ISP